# Altium schematic sheet ADC.SchDoc
size A4; SheetNumber: 8; SheetTotal: 8
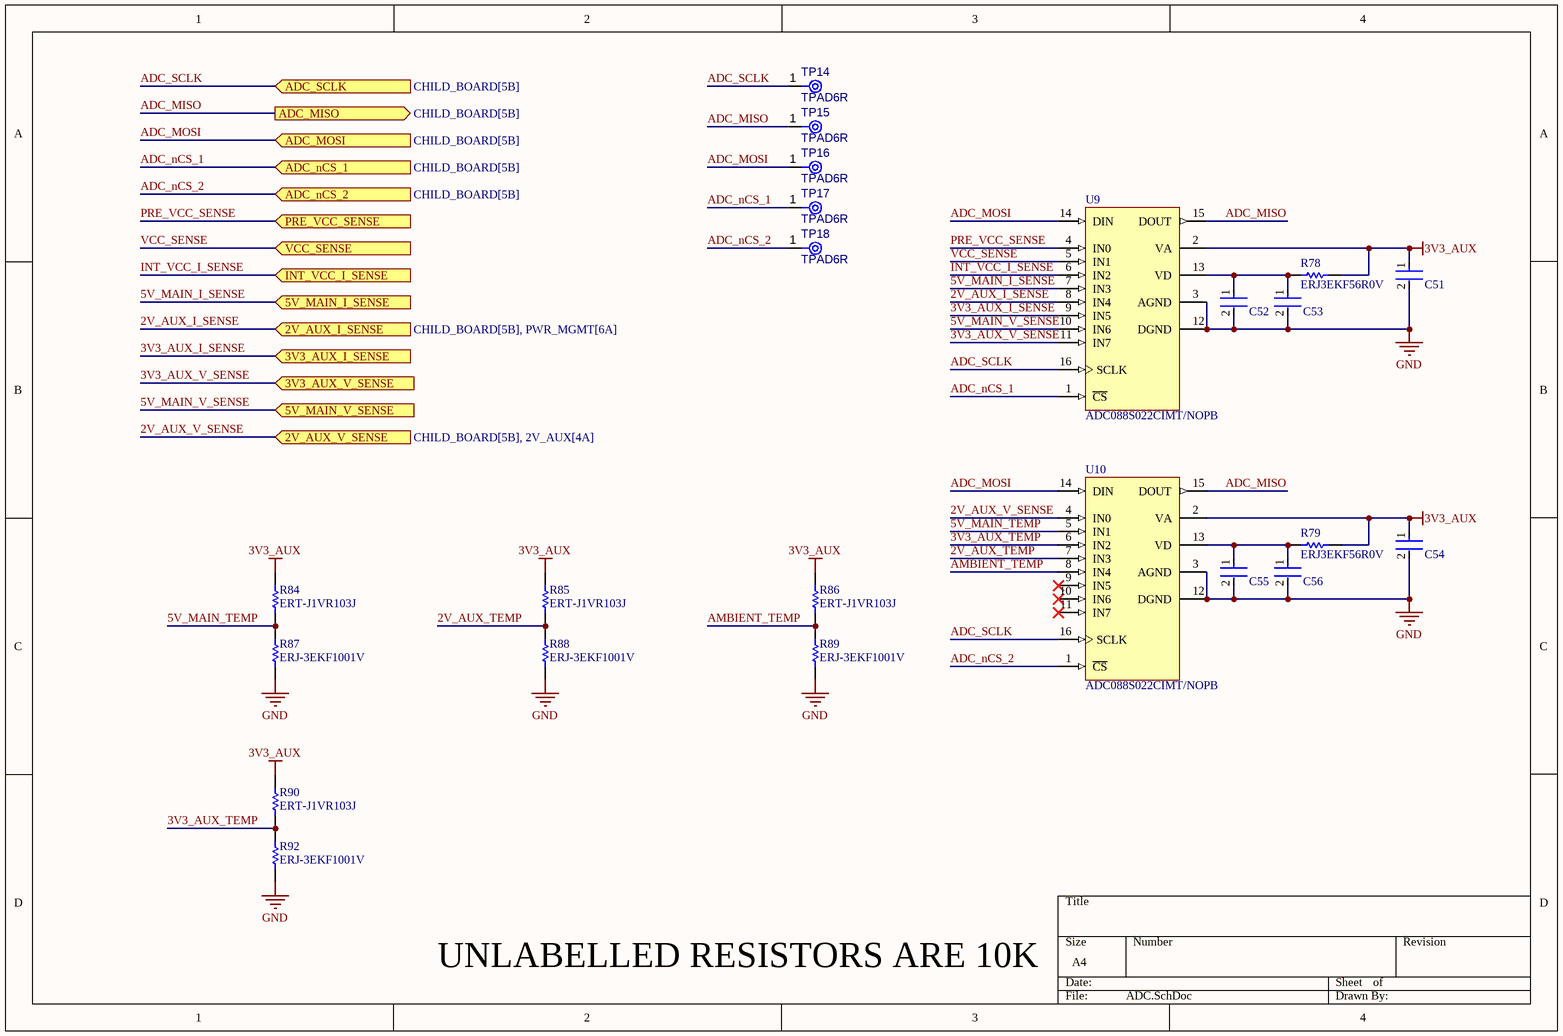
[diagram p0: ADC.SchDoc]

## Parts
C51  C0402C104K8PACTU  [FP-C0402-BB-MFG]  (value not drawn)
C52  C0402C104K8PACTU  [FP-C0402-BB-MFG]  (value not drawn)
C53  C0402C104K8PACTU  [FP-C0402-BB-MFG]  (value not drawn)
C54  C0402C104K8PACTU  [FP-C0402-BB-MFG]  (value not drawn)
C55  C0402C104K8PACTU  [FP-C0402-BB-MFG]  (value not drawn)
C56  C0402C104K8PACTU  [FP-C0402-BB-MFG]  (value not drawn)
R78  ERJ3EKF56R0V  [RESC1608X55X30NL15T15]
R79  ERJ3EKF56R0V  [RESC1608X55X30NL15T15]
R84  ERT-J1VR103J  [RESC1608X90X30ML15T20]
R85  ERT-J1VR103J  [RESC1608X90X30ML15T20]
R86  ERT-J1VR103J  [RESC1608X90X30ML15T20]
R87  ERJ-3EKF1001V  [RESC1608X55X30LL15T15]
R88  ERJ-3EKF1001V  [RESC1608X55X30LL15T15]
R89  ERJ-3EKF1001V  [RESC1608X55X30LL15T15]
R90  ERT-J1VR103J  [RESC1608X90X30ML15T20]
R92  ERJ-3EKF1001V  [RESC1608X55X30LL15T15]
TP14  TPAD6R  [TP06R]  (no BOM)
TP15  TPAD6R  [TP06R]  (no BOM)
TP16  TPAD6R  [TP06R]  (no BOM)
TP17  TPAD6R  [TP06R]  (no BOM)
TP18  TPAD6R  [TP06R]  (no BOM)
U9  ADC088S022CIMT/NOPB  [MTC16_L]
U10  ADC088S022CIMT/NOPB  [MTC16_L]

## Ports
2V_AUX_I_SENSE (in, see CHILD_BOARD[5B], PWR_MGMT[6A]), 2V_AUX_V_SENSE (in, see CHILD_BOARD[5B], 2V_AUX[4A]), 3V3_AUX_I_SENSE (in, see CHILD_BOARD[5B], PWR_MGMT[6A]), 3V3_AUX_V_SENSE (in, see CHILD_BOARD[5A], 3V3_AUX[4A]), 5V_MAIN_I_SENSE (in, see CHILD_BOARD[5B], PWR_MGMT[6A]), 5V_MAIN_V_SENSE (in, see CHILD_BOARD[5A], 5V_MAIN[4A]), ADC_MISO (out, see CHILD_BOARD[5B]), ADC_MOSI (in, see CHILD_BOARD[5B]), ADC_nCS_1 (in, see CHILD_BOARD[5B]), ADC_nCS_2 (in, see CHILD_BOARD[5B]), ADC_SCLK (in, see CHILD_BOARD[5B]), INT_VCC_I_SENSE (in, see CHILD_BOARD[5B], PWR_MGMT[6A]), PRE_VCC_SENSE (in, see CHILD_BOARD[5B], PWR_MGMT[6A]), VCC_SENSE (in, see CHILD_BOARD[5B], PWR_MGMT[6A])

## Nets
3V3_AUX: C51.1 C54.1 R78.1 R79.1 R84.2 R85.2 R86.2 R90.2 U9.2(VA) U10.2(VA)
GND: C51.2 C52.2 C53.2 C54.2 C55.2 C56.2 R87.1 R88.1 R89.1 R92.1 U9.3(AGND) U9.12(DGND) U10.3(AGND) U10.12(DGND)
2V_AUX_I_SENSE: U9.8(IN4) ; port 2V_AUX_I_SENSE
2V_AUX_TEMP: R85.1 R88.2 U10.7(IN3)
2V_AUX_V_SENSE: U10.4(IN0) ; port 2V_AUX_V_SENSE
3V3_AUX_I_SENSE: U9.9(IN5) ; port 3V3_AUX_I_SENSE
3V3_AUX_TEMP: R90.1 R92.2 U10.6(IN2)
3V3_AUX_V_SENSE: U9.11(IN7) ; port 3V3_AUX_V_SENSE
5V_MAIN_I_SENSE: U9.7(IN3) ; port 5V_MAIN_I_SENSE
5V_MAIN_TEMP: R84.1 R87.2 U10.5(IN1)
5V_MAIN_V_SENSE: U9.10(IN6) ; port 5V_MAIN_V_SENSE
ADC_MISO: TP15.1(TP) U9.15(DOUT) U10.15(DOUT) ; port ADC_MISO
ADC_MOSI: TP16.1(TP) U9.14(DIN) U10.14(DIN) ; port ADC_MOSI
ADC_nCS_1: TP17.1(TP) U9.1(~{CS}) ; port ADC_nCS_1
ADC_nCS_2: TP18.1(TP) U10.1(~{CS}) ; port ADC_nCS_2
ADC_SCLK: TP14.1(TP) U9.16(SCLK) U10.16(SCLK) ; port ADC_SCLK
AMBIENT_TEMP: R86.1 R89.2 U10.8(IN4)
INT_VCC_I_SENSE: U9.6(IN2) ; port INT_VCC_I_SENSE
PRE_VCC_SENSE: U9.4(IN0) ; port PRE_VCC_SENSE
VCC_SENSE: U9.5(IN1) ; port VCC_SENSE
NetC52_1: C52.1 C53.1 R78.2 U9.13(VD)
NetC55_1: C55.1 C56.1 R79.2 U10.13(VD)

Not connected (* = marked no-connect by the designer): U10 9(IN5)* 10(IN6)* 11(IN7)*

## Notes on the sheet
- UNLABELLED RESISTORS ARE 10K

## Library data of the parts
C51-C56 = CMP-2008-02046-2: CAP CER 0.1UF 10V X5R 0402; Manufacturer: Kemet; Material: Ceramic; Capacitance: 0.10 μF; Temperature Coefficient: 15%; Tolerance: 0.1; Value: 0.10 μF; Package: C0402-BB; Temperature: -55°C to +125°C; ComponentLink2Description: Datasheet; Temperature Characteristic: X5R; Device Class L1: Passive Components; Height: 0.55mm; Lead Free: Yes; ComponentLink2URL: https://content.kemet.com/datasheets/KEM_C1002_X7R_SMD.pdf; Device Class L2: Capacitors; Temperature Range Low: -55°C; Temperature Range High: +125°C; RoHS: TRUE; Octopart: https://octopart.com/c0402c104k8pactu-kemet-140039; Automotive: No; Mouser Description: Capacitor 100 nF 10 VDC 0402; Category: Cap; Voltage Rating: 10 V; Digikey Description: CAP CER 0.1UF 10V X5R 0402; Ipc Land Pattern Name: CAPC10050X50; Device Class L3: Ceramic Capacitors; Manufacturer Part Number: C0402C104K8PACTU
R78 R79 = CMP-2000-00572-1: Manufacturer: Panasonic; Part Number: ERJ3EKF56R0V
R84-R86 R90 = CMP-2000-00869-1: Manufacturer: Panasonic; Part Number: ERT-J1VR103J
R87-R89 R92 = CMP-2000-00180-1: Manufacturer: Panasonic; Part Number: ERJ-3EKF1001V
TP14-TP18 = CMP-00028-00002-2: 0.6mm round; Pins: 1
U9 U10 = CMP-0054-00372-2: 8-Channel, 50 kSPS to 200 kSPS, 8-Bit A/D Converter, 16-pin TSSOP, Pb-Free; Manufacturer: National Semiconductor; PackageTopMarking: NSUZXYTT*88S022*CIMT; CompType: ADC IC; PowerWise: Y; ComponentLink2URL: http://www.national.com/pf/AD/ADC088S022.html; RoHS: Y; PackageDescription: Molded TSSOP, Jedec, 5 x 4.4 x 0.9mm Body, 16 Lead, 0.65mm Pitch; DatasheetVersion: Feb-2010; PinCount: 16; ComponentLink1Description: ADC088S022 Datasheet; Code_JEDEC: MO-153-AB; ComponentLink3URL: http://www.national.com/packaging/folders/mtc16.html; PackageVersion: revD, Jun-2003; ComponentLink3Description: MTC16 Package Page; RevisionNote: Component URLs added; ComponentLink1URL: http://www.national.com/ds/AD/ADC088S022.pdf; ComponentLink2Description: ADC088S022 Web Page; PackageReference: MTC16